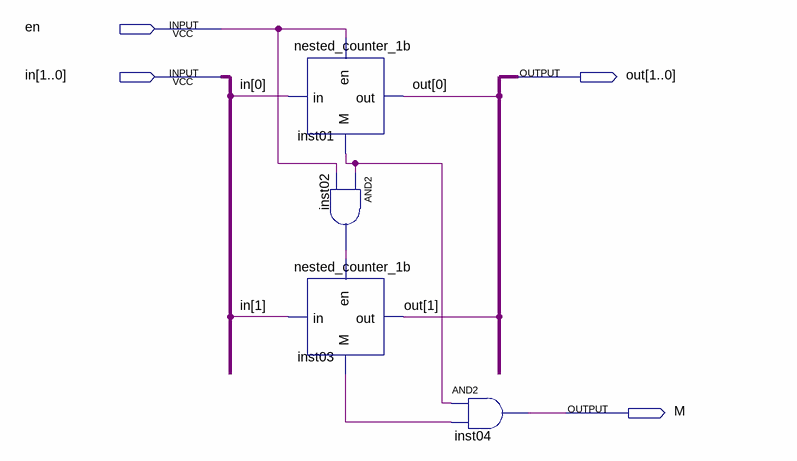
[diagram p0: schematic sheet]
// Quartus schematic nested_counter_2b.bdf as structural Verilog: 4 symbols, 4 pins
module nested_counter_2b (
  input  en,
  input  [1:0] in,
  output [1:0] out,
  output M
);

  wire inst01_m, inst02_out, inst03_m;

  nested_counter_1b inst01 (.en(en), .in(in[0]), .out(out[0]), .M(inst01_m));
  and inst02 (inst02_out, inst01_m, en);
  nested_counter_1b inst03 (.en(inst02_out), .in(in[1]), .out(out[1]), .M(inst03_m));
  and inst04 (M, inst01_m, inst03_m);
endmodule
